# EAGLE design printer_v1 (EAGLE 9.6.2)
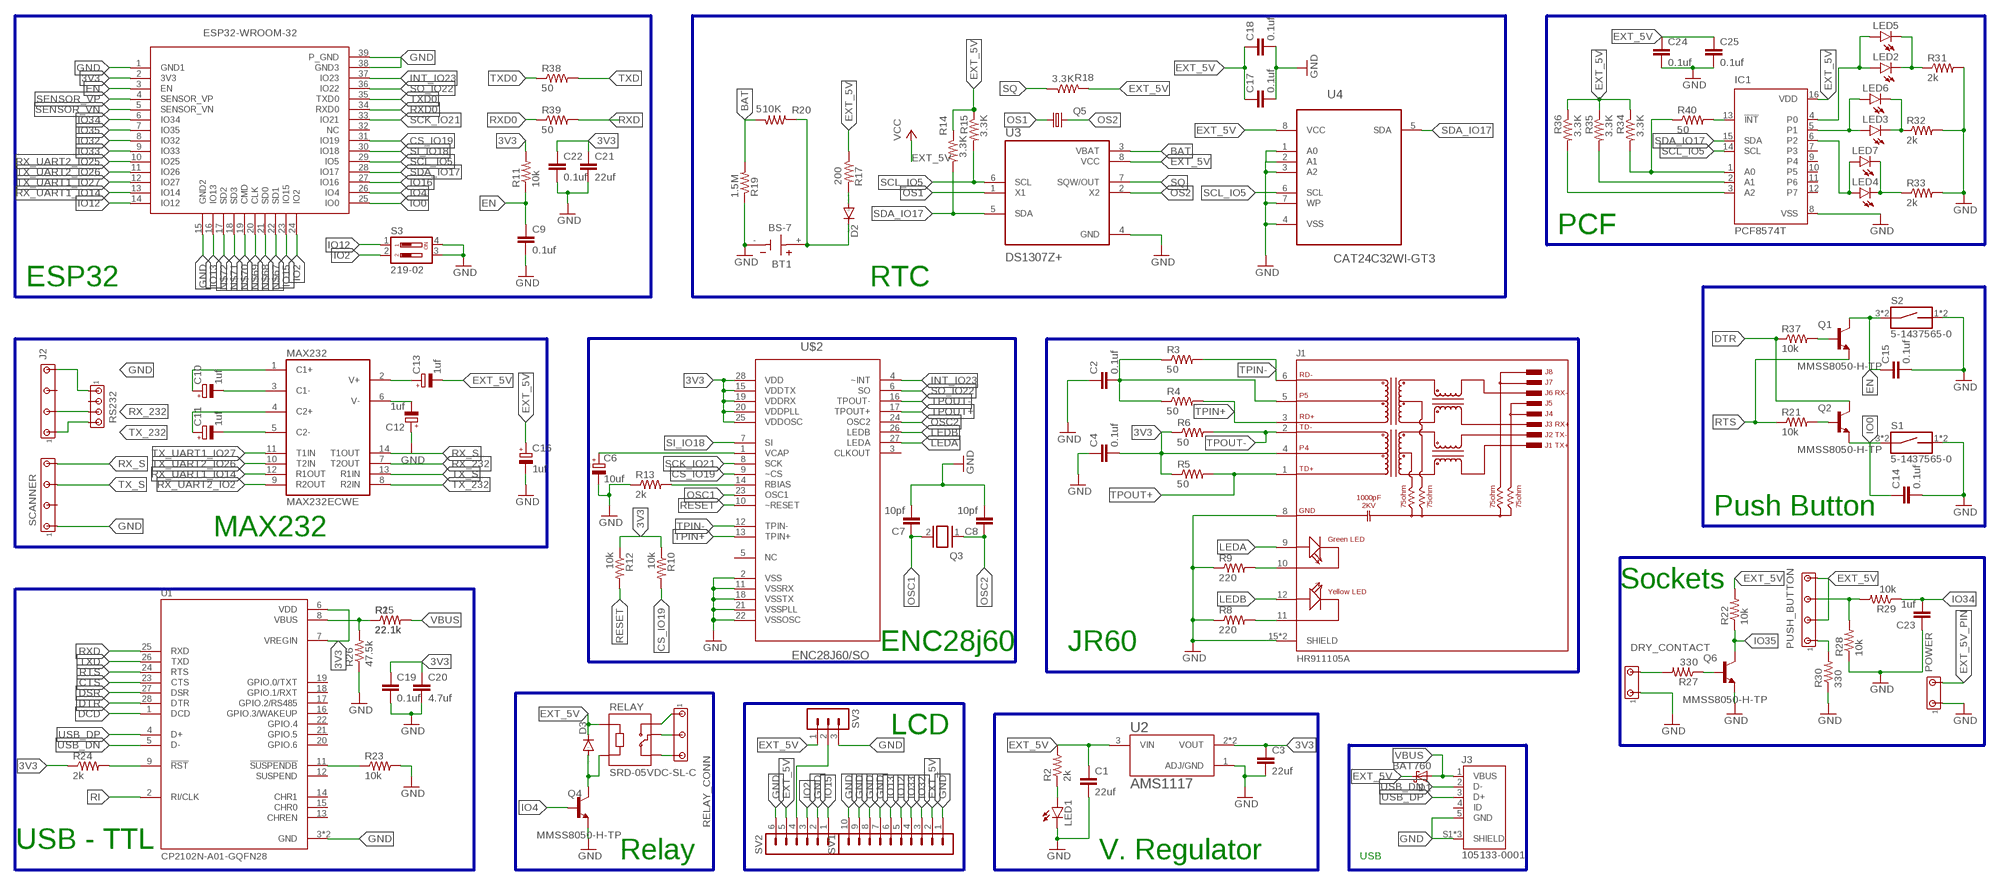
[diagram p0: schematic, sheet 1, part 1 of 2]
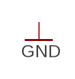
[diagram p1: schematic, sheet 1, part 2 of 2]

## Parts
BT1  BS-7  [BAT_BS-7]
C1  22uf  C-EUC0603  [C0603]
C2  0.1uf  C-EUC0402  [C0402]
C3  22uf  C-EUC0603  [C0603]
C4  0.1uf  C-EUC0402  [C0402]
C6  10uf  CPOL-EU153CLV-0405  [153CLV-0405]
C7  10pf  C-EUC0402  [C0402]
C8  10pf  C-EUC0402  [C0402]
C9  0.1uf  C-EUC0402  [C0402]
C10  1uf  CPOL-EUA/3216-18R  [A/3216-18R]
C11  1uf  CPOL-EUA/3216-18R  [A/3216-18R]
C12  1uf  CPOL-EUA/3216-18R  [A/3216-18R]
C13  1uf  CPOL-EUA/3216-18R  [A/3216-18R]
C14  0.1uf  C-EUC0402  [C0402]
C15  0.1uf  C-EUC0402  [C0402]
C16  1uf  CPOL-EUA/3216-18R  [A/3216-18R]
C17  0.1uf  C-EUC0402  [C0402]
C18  0.1uf  C-EUC0402  [C0402]
C19  0.1uf  C-EUC0402  [C0402]
C20  4.7uf  C-EUC0402  [C0402]
C21  22uf  C-EUC0603  [C0603]
C22  0.1uf  C-EUC0402  [C0402]
C23  1uf  C-EUC0603  [C0603]
C24  0.1uf  C-EUC0402  [C0402]
C25  0.1uf  C-EUC0402  [C0402]
D1  BAT760  [SOD323(F)]
D2  DIODE-DO-214AC  [DO-214AC]
D3  DIODE-DO-214AC  [DO-214AC]
DRY_CONTACT  MTA03-100_MYV  [10X03MTA_MYV]
IC1  PCF8574T  [SO16W]
J1  HR911105A  [HANRUN_HR911105A]
J2  MTA07-100_MYV  [10X07MTA_MYV]
J3  105133-0001  [MOLEX_105133-0001]
LED1  LEDSML0603  [SML0603]
LED2  LEDSML0603  [SML0603]
LED3  LEDSML0603  [SML0603]
LED4  LEDSML0603  [SML0603]
LED5  LED5MM  [LED5MM]
LED6  LED5MM  [LED5MM]
LED7  LED5MM  [LED5MM]
MAX232  MAX232ECWE  [SO16L]
POWER  MTA03-100_MYV  [10X03MTA_MYV]
PUSH_BUTTON  MTA07-100_MYV  [10X07MTA_MYV]
Q1  MMSS8050-H-TP  [TRANS_MMSS8050-H-TP]
Q2  MMSS8050-H-TP  [TRANS_MMSS8050-H-TP]
Q3  XTAL/S  [QS]
Q4  MMSS8050-H-TP  [TRANS_MMSS8050-H-TP]
Q5  KX-327-NHF  [3.2X1.5]
Q6  MMSS8050-H-TP  [TRANS_MMSS8050-H-TP]
R1  22.1k  R-US_R0402  [R0402]
R2  2k  R-US_R0402  [R0402]
R3  50  R-US_R0402  [R0402]
R4  50  R-US_R0402  [R0402]
R5  50  R-US_R0402  [R0402]
R6  50  R-US_R0402  [R0402]
R8  220  R-US_R0402  [R0402]
R9  220  R-US_R0402  [R0402]
R10  10k  R-US_R0402  [R0402]
R11  10k  R-US_R0402  [R0402]
R12  10k  R-US_R0402  [R0402]
R13  2k  R-US_R0402  [R0402]
R14  3.3K  R-US_R0603  [R0603]
R15  3.3K  R-US_R0603  [R0603]
R17  200  R-US_R0603  [R0603]
R18  3.3K  R-US_R0603  [R0603]
R19  1.5M  R-US_R0603  [R0603]
R20  510K  R-US_R0603  [R0603]
R21  10k  R-US_R0402  [R0402]
R22  10k  R-US_R0402  [R0402]
R23  10k  R-US_R0402  [R0402]
R24  2k  R-US_R0402  [R0402]
R25  22.1k  R-US_R0402  [R0402]
R26  47.5k  R-US_R0402  [R0402]
R27  330  R-US_R0402  [R0402]
R28  10k  R-US_R0402  [R0402]
R29  10k  R-US_R0402  [R0402]
R30  330  R-US_R0402  [R0402]
R31  2k  R-US_R0402  [R0402]
R32  2k  R-US_R0402  [R0402]
R33  2k  R-US_R0402  [R0402]
R34  3.3K  R-US_R0603  [R0603]
R35  3.3K  R-US_R0603  [R0603]
R36  3.3K  R-US_R0603  [R0603]
R37  10k  R-US_R0402  [R0402]
R38  50  R-US_R0402  [R0402]
R39  50  R-US_R0402  [R0402]
R40  50  R-US_R0402  [R0402]
RELAY  SRD-05VDC-SL-C  [RELAY_SRD-05VDC-SL-C]
RELAY_CONN  MTA05-156_MYVSPACE1  [10X05MTA_MYV]
RS232  MTA04-100  [10X04MTA]
S1  5-1437565-0  [SW_5-1437565-0]
S2  5-1437565-0  [SW_5-1437565-0]
S3  219-02  [CTS-219-02]
SCANNER  MTA07-100_MYV  [10X07MTA_MYV]
SV1  MA10-1  [MA10-1]
SV2  MA06-1  [MA06-1]
SV3  MA03-1  [MA03-1]
U1  CP2102N-A01-GQFN28  [QFN50P500X500X80-29N]
U2  AMS1117  [SOT229P700X180-4N]
U3  DS1307Z+  [SOIC127P600X175-8N]
U4  CAT24C32WI-GT3  [SOIC127P600X175-8N]
U$2  ENC28J60/SO  [SOIC127P1034X264-28N]
U$3  ESP32-WROOM-32  [ESP32-WROOM-32]

## Nets
3V3: C3.1 C4.2 C19.1 C20.1 C21.1 C22.1 J1.4 R5.1 R6.1 R10.1 R11.2 R12.1 R24.1 U1.6(VDD) U1.7(VREGIN) U2.2(VOUT) U2.4(VOUT) U$2.15(VDDTX) U$2.19(VDDRX) U$2.20(VDDPLL) U$2.25(VDDOSC) U$2.28(VDD) U$3.2(3V3)
BAT: R19.2 R20.2 U3.3(VBAT)
CS_IO19: R10.2 U$2.9(~CS) U$3.31(IO19)
CTS: U1.23(CTS)
DCD: U1.1(DCD)
DSR: U1.27(DSR)
DTR: Q2.3(C) R37.1 U1.28(DTR)
EN: C9.1 C15.1 Q1.3(C) R11.1 S2.3 S2.4 U$3.3(EN)
EXT_5V: C1.1 C13.- C16.+ C17.1 C18.1 C24.1 C25.1 D1.1(K) D3.C IC1.16(VDD) PUSH_BUTTON.3 PUSH_BUTTON.7 R2.2 R14.1 R15.1 R17.1 R18.2 R22.2 R34.1 R35.1 R36.1 RELAY.A1 SV1.2 SV2.5 SV3.1 U2.3(VIN) U3.8(VCC) U4.8(VCC) ; supply symbol labelled VCC
EXT_5V_PIN: POWER.3
GND: BT1.- C1.2 C2.1 C3.2 C4.1 C6.- C7.2 C8.2 C9.2 C12.+ C14.2 C15.2 C16.- C17.2 C18.2 C19.2 C20.2 C21.2 C22.2 C23.1 C24.2 C25.2 DRY_CONTACT.1 IC1.8(VSS) J1.8(GND) J1.15(SHIELD) J1.16(SHIELD) J2.7 J3.5(GND) J3.S1(SHIELD) J3.S2(SHIELD) J3.S3(SHIELD) LED1.C POWER.1 Q4.2(E) Q6.2(E) R8.1 R9.1 R13.1 R19.1 R23.2 R26.1 R28.1 R30.1 R31.2 R32.2 R33.2 RS232.1 S1.1 S1.2 S2.1 S2.2 S3.3 S3.4 SCANNER.1 SV1.1 SV1.7 SV1.8 SV1.9 SV1.10 SV2.2 SV2.6 SV3.3 U1.3(GND) U1.29(GND) U2.1(ADJ/GND) U3.4(GND) U4.1(A0) U4.2(A1) U4.3(A2) U4.4(VSS) U4.7(WP) U$2.2(VSS) U$2.11(VSSRX) U$2.18(VSSTX) U$2.21(VSSPLL) U$2.22(VSSOSC) U$3.1(GND1) U$3.15(GND2) U$3.38(GND3) U$3.39(P_GND)
INT_IO23: U$2.4(~INT) U$3.37(IO23)
IO0: C14.1 Q2.2(E) S1.3 S1.4 U$3.25(IO0)
IO2: S3.2 SV2.3 U$3.24(IO2)
IO4: Q4.1(B) U$3.26(IO4)
IO12: S3.1 SV1.5 U$3.14(IO12)
IO13: SV1.6 U$3.16(IO13)
IO15: SV2.1 U$3.23(IO15)
IO16: U$3.27(IO16)
IO32: SV1.3 U$3.8(IO32)
IO33: SV1.4 U$3.9(IO33)
IO34: C23.2 R29.1 U$3.6(IO34)
IO35: Q6.3(C) R22.1 U$3.7(IO35)
LEDA: J1.9(GA) U$2.27(LEDA)
LEDB: J1.12(YA) U$2.26(LEDB)
N$1: LED1.A R2.1
N$2: Q1.1(B) R37.2
N$3: Q2.1(B) R21.2
N$4: R1.1 R25.1 R26.2 U1.8(VBUS)
N$5: SV2.4 SV3.2
N$6: R23.1 U1.11(!SUSPENDB)
N$7: J1.11(YC) R8.2
N$8: C2.2 J1.5 R3.1 R4.1
N$9: J1.10(GC) R9.2
N$10: R13.2 U$2.14(RBIAS)
N$11: C6.+ U$2.1(VCAP)
N$12: C10.+ MAX232.1(C1+)
N$14: C10.- MAX232.3(C1-)
N$15: C11.- MAX232.5(C2-)
N$16: R24.2 U1.9(!RST)
N$18: C11.+ MAX232.4(C2+)
N$19: C12.- MAX232.6(V-)
N$20: C13.+ MAX232.2(V+)
N$21: RELAY.NC RELAY_CONN.5
N$22: RELAY.COM RELAY_CONN.3
N$23: LED2.C LED5.K(C) R31.1
N$24: IC1.13(!INT) R40.2
N$26: RELAY.NO RELAY_CONN.1
N$27: D3.A Q4.3(C) RELAY.A2
N$28: D2.A R17.2
N$29: BT1.+ D2.C R20.1
N$32: Q6.1(B) R27.1
N$33: PUSH_BUTTON.5 R28.2 R29.2
N$35: DRY_CONTACT.3 R27.2
N$36: IC1.4(P0) LED2.A LED5.A
N$37: IC1.5(P1) LED3.A LED6.A
N$38: IC1.6(P2) LED4.A LED7.A
N$40: PUSH_BUTTON.1 R30.2
N$45: IC1.1(A0) R34.2 R40.1
N$46: IC1.2(A1) R35.2
N$47: IC1.3(A2) R36.2
N$48: LED3.C LED6.K(C) R32.1
N$49: LED4.C LED7.K(C) R33.1
N$67: U$3.22(SD1)
N$68: U$3.21(SD0)
N$69: U$3.20(CLK)
N$70: U$3.19(CMD)
N$71: U$3.18(SD3)
N$72: U$3.17(SD2)
OS1: Q5.1 U3.1(X1)
OS2: Q5.2 U3.2(X2)
OSC1: C7.1 Q3.2 U$2.23(OSC1)
OSC2: C8.1 Q3.1 U$2.24(OSC2)
RESET: R12.2 U$2.10(~RESET)
RI: U1.2(RI/CLK)
RTS: Q1.2(E) R21.1 U1.24(RTS)
RX_232: J2.3 MAX232.7(T2OUT) RS232.3
RX_S: MAX232.14(T1OUT) SCANNER.7
RX_UART1_IO14: MAX232.12(R1OUT) U$3.13(IO14)
RX_UART2_IO2: MAX232.9(R2OUT)
RX_UART2_IO25: U$3.10(IO25)
RXD: R39.2 U1.25(RXD)
RXD0: R39.1 U$3.34(RXD0)
SCK_IO21: U$2.8(SCK) U$3.33(IO21)
SCL_IO5: IC1.14(SCL) R15.2 U3.6(SCL) U4.6(SCL) U$3.29(IO5)
SDA_IO17: IC1.15(SDA) R14.2 U3.5(SDA) U4.5(SDA) U$3.28(IO17)
SENSOR_VN: U$3.5(SENSOR_VN)
SENSOR_VP: U$3.4(SENSOR_VP)
SI_IO18: U$2.7(SI) U$3.30(IO18)
SO_IO22: U$2.6(SO) U$3.36(IO22)
SQ: R18.1 U3.7(SQW/OUT)
TPIN+: J1.3(RD+) R4.2 U$2.13(TPIN+)
TPIN-: J1.6(RD-) R3.2 U$2.12(TPIN-)
TPOUT+: J1.1(TD+) R5.2 U$2.17(TPOUT+)
TPOUT-: J1.2(TD-) R6.2 U$2.16(TPOUT-)
TX_232: J2.1 MAX232.8(R2IN) RS232.4
TX_S: MAX232.13(R1IN) SCANNER.5
TX_UART1_IO27: MAX232.11(T1IN) U$3.12(IO27)
TX_UART2_IO26: MAX232.10(T2IN) U$3.11(IO26)
TXD: R38.2 U1.26(TXD)
TXD0: R38.1 U$3.35(TXD0)
USB_DN: J3.2(D-) U1.5(D-)
USB_DP: J3.3(D+) U1.4(D+)
VBUS: D1.2(A) J3.1(VBUS) R1.2 R25.2
Unconnected: IC1.7(P3) IC1.9(P4) IC1.10(P5) IC1.11(P6) IC1.12(P7) J2.5 J3.4(ID) RS232.2 SCANNER.3 U1.12(SUSPEND) U1.13(CHREN) U1.14(CHR1) U1.15(CHR0) U1.16(GPIO.3/WAKEUP) U1.17(GPIO.2/RS485) U1.18(GPIO.1/RXT) U1.19(GPIO.0/TXT) U1.20(GPIO.6) U1.21(GPIO.5) U1.22(GPIO.4) U$2.3(CLKOUT) U$2.5(NC) U$3.32(NC)

## Buses
B$1
B$2
EXT_5V,GND,N$28,BAT,N$29
B$3
B$4
B$5
B$6
B$7
GND,EXT_5V_PIN
B$8
VBUS,GND,USB_DN,N$6,3V3,RI,RTS,RXD,TXD,CTS,DSR,N$4,DTR,DCD,USB_DP,N$16
B$9
B$10

## Notes on the sheet
- PCF
- ESP32 | RTC
- Push Button
- MAX232
- Sockets
- ENC28j60 | JR60
- LCD
- USB - TTL
- Relay | V. Regulator | USB

## Power pins joined to a net without a drawn wire
EXT_5V: MAX232.16(VCC)
GND: MAX232.15(GND)

## Library data of the parts
BT1 = BS-7:BS-7: BATTERY HOLDER COIN 20MM PC PIN; AVAILABILITY: Unavailable; DESCRIPTION: BATTERY HOLDER COIN 20MM PC PIN; MF: MPD _Memory; MP: BS-7; PACKAGE: None; PRICE: None
C1-C4 C7-C9 C14 C15 C17-C25 = rcl:C-EU: CAPACITOR, European symbol; SPICEPREFIX: C
C6 C10-C13 C16 = rcl:CPOL-EU: POLARIZED CAPACITOR, European symbol; SPICEPREFIX: C
D1 = BAT760:BAT760: Medium power Schottky barrier single diode Planar medium power Schottky barrier single diode with an integrated guard ring for stress protection, encapsulated in a SOD323 (SC-76) very small Surface-Mounted Device SMD plastic package. AAL Eindhoven MK; AVAILABILITY: Unavailable; DESCRIPTION: Diode Schottky 30V 1A Surface Mount SOD-323; MF: Nexperia USA; MP: BAT760; PACKAGE: SOD-323 NXP Semiconductors; PRICE: None
D2 D3 = diode:DIODE-: DIODE
DRY_CONTACT POWER = con-amp_edit:MTA03-100_MYV: AMP connector
IC1 = micro-philips:PCF8574: I2C-Bus Remote 8-bit I/O expander http://www.semiconductors.philips.com/acrobat_download/datasheets/PCF8574_4.pdf; MPN: PCF8574T/3,512; OC_FARNELL: 1201255; OC_NEWARK: 70R6870
J1 = HR911105A:HR911105A: DIP RJ45 Connector;; AVAILABILITY: Unavailable; DESCRIPTION: HR911105A Ethernet Interface Arduino Platform Evaluation Expansion Board; MF: DFRobot; MP: HR911105A; PACKAGE: None; PRICE: None
J2 PUSH_BUTTON SCANNER = con-amp_edit:MTA07-100_MYV: AMP connector
J3 = 105133-0001:105133-0001: Conn Micro USB Type B RCP 5 POS 0.65mm Solder RA SMD 5 Terminal 1 Port Embossed T/R; AVAILABILITY: Unavailable; DESCRIPTION: USB - micro B USB 2.0 Receptacle Connector 5 Position Surface Mount; MF: Molex; MP: 105133-0001; PACKAGE: None; PRICE: None
LED1-LED4 = led:LED: LED OSRAM: - CHIPLED LG R971, LG N971, LY N971, LG Q971, LY Q971, LO R971, LY R971 LH N974, LH R974 LS Q976, LO Q976, LY Q976 LO Q996 - Hyper CHIPLED LW Q18S LB Q993, LB Q99A, LB R99A - SideLED LS A670, LO A670, LY A670, LG A670, LP A670 LB A673, LV A673, LT A673, LW A673 LH A674 LY A675 LS A676, LA A676, LO A676, LY A676, LW A676 LS A679, LY A679, LG A679 - Hyper Micro SIDELED® LS Y876, LA Y876, LO Y876, LY Y876 LT Y87S - SmartLED LW L88C, LW L88S LB L89C, LB L89S, LG L890 LS L89K, LO L89K, LY L89K LS L896, LA L896, LO L896, LY L896 - TOPLED LS T670, LO T670, LY T670, LG T670, LP T670 LSG T670, LSP T670, LSY T670, LOP T670, LYG T670 LG T671, LOG T671, LSG T671 LB T673, LV T673, LT T673, LW T673 LH T674 LS T676, LA T676, LO T676, LY T676, LB T676, LH T676, LSB T676, LW T676 LB T67C, LV T67C, LT T67C, LS T67K, LO T67K, LY T67K, LW E67C LS E67B, LA E67B, LO E67B, LY E67B, LB E67C, LV E67C, LT E67C LW T67C LS T679, LY T679, LG T679 LS T770, LO T770, LY T770, LG T770, LP T770 LB T773, LV T773, LT T773, LW T773 LH T774 LS E675, LA E675, LY E675, LS T675 LS T776, LA T776, LO T776, LY T776, LB T776 LHGB T686 LT T68C, LB T68C - Hyper Mini TOPLED® LB M676 - Mini TOPLED Santana® LG M470 LS M47K, LO M47K, LY M47K Source: http://www.osram.convergy.de LUXEON: - LUMILED® LXK2-PW12-R00, LXK2-PW12-S00, LXK2-PW14-U00, LXK2-PW14-V00 LXK2-PM12-R00, LXK2-PM12-S00, LXK2-PM14-U00 LXK2-PE12-Q00, LXK2-PE12-R00, LXK2-PE12-S00, LXK2-PE14-T00, LXK2-PE14-U00 LXK2-PB12-K00, LXK2-PB12-L00, LXK2-PB12-M00, LXK2-PB14-N00, LXK2-PB14-P00, LXK2-PB14-Q00 LXK2-PR12-L00, LXK2-PR12-M00, LXK2-PR14-Q00, LXK2-PR14-R00 LXK2-PD12-Q00, LXK2-PD12-R00, LXK2-PD12-S00 LXK2-PH12-R00, LXK2-PH12-S00 LXK2-PL12-P00, LXK2-PL12-Q00, LXK2-PL12-R00 Source: www.luxeon.com KINGBRIGHT: KA-3528ASYC Source: www.kingbright.com
LED5-LED7 = led_MYVV:LED: LED OSRAM: - CHIPLED LG R971, LG N971, LY N971, LG Q971, LY Q971, LO R971, LY R971 LH N974, LH R974 LS Q976, LO Q976, LY Q976 LO Q996 - Hyper CHIPLED LW Q18S LB Q993, LB Q99A, LB R99A - SideLED LS A670, LO A670, LY A670, LG A670, LP A670 LB A673, LV A673, LT A673, LW A673 LH A674 LY A675 LS A676, LA A676, LO A676, LY A676, LW A676 LS A679, LY A679, LG A679 - Hyper Micro SIDELED® LS Y876, LA Y876, LO Y876, LY Y876 LT Y87S - SmartLED LW L88C, LW L88S LB L89C, LB L89S, LG L890 LS L89K, LO L89K, LY L89K LS L896, LA L896, LO L896, LY L896 - TOPLED LS T670, LO T670, LY T670, LG T670, LP T670 LSG T670, LSP T670, LSY T670, LOP T670, LYG T670 LG T671, LOG T671, LSG T671 LB T673, LV T673, LT T673, LW T673 LH T674 LS T676, LA T676, LO T676, LY T676, LB T676, LH T676, LSB T676, LW T676 LB T67C, LV T67C, LT T67C, LS T67K, LO T67K, LY T67K, LW E67C LS E67B, LA E67B, LO E67B, LY E67B, LB E67C, LV E67C, LT E67C LW T67C LS T679, LY T679, LG T679 LS T770, LO T770, LY T770, LG T770, LP T770 LB T773, LV T773, LT T773, LW T773 LH T774 LS E675, LA E675, LY E675, LS T675 LS T776, LA T776, LO T776, LY T776, LB T776 LHGB T686 LT T68C, LB T68C - Hyper Mini TOPLED® LB M676 - Mini TOPLED Santana® LG M470 LS M47K, LO M47K, LY M47K Source: http://www.osram.convergy.de LUXEON: - LUMILED® LXK2-PW12-R00, LXK2-PW12-S00, LXK2-PW14-U00, LXK2-PW14-V00 LXK2-PM12-R00, LXK2-PM12-S00, LXK2-PM14-U00 LXK2-PE12-Q00, LXK2-PE12-R00, LXK2-PE12-S00, LXK2-PE14-T00, LXK2-PE14-U00 LXK2-PB12-K00, LXK2-PB12-L00, LXK2-PB12-M00, LXK2-PB14-N00, LXK2-PB14-P00, LXK2-PB14-Q00 LXK2-PR12-L00, LXK2-PR12-M00, LXK2-PR14-Q00, LXK2-PR14-R00 LXK2-PD12-Q00, LXK2-PD12-R00, LXK2-PD12-S00 LXK2-PH12-R00, LXK2-PH12-S00 LXK2-PL12-P00, LXK2-PL12-Q00, LXK2-PL12-R00 Source: www.luxeon.com KINGBRIGHT: KA-3528ASYC Source: www.kingbright.com
MAX232 = maxim:MAX232ECWE: RS232 TRANSCEIVER; MF: MAXIM; MPN: MAX232ECWE+; OC_FARNELL: 9724435; OC_NEWARK: 67K4440
Q1 Q2 Q4 Q6 = MMSS8050-H-TP:MMSS8050-H-TP: MMSS8050-H Series 25 V 1.5 A NPN Silicon Plastic-Encapsulate Transistor-SOT-23; AVAILABILITY: Unavailable; DESCRIPTION: Bipolar _BJT_ Transistor NPN 25V 1.5A 100MHz 625mW Surface Mount SOT-23; MF: Micro Commercial; MP: MMSS8050-H-TP; PACKAGE: SOT-23 Micro Commercial; PRICE: None
Q3 = special:XTAL/S: CRYSTAL
Q5 = crystal-geyer_V1_0:KX-327: Tuning Fork Crystals (kHz) SMD: KX327 - Serie Model Size l/w/h [mm] Frequency Range Frequency Stability Temp. Range [°C] Load Capacitance AECQ 200 availabel Datasheet KX-327VT KX-327FT KX-327RT KX-327NHT KX-327NHF KX-327L KX-327S 1.25/1.05/0.5 1.6/1.0/0.5 2.0/1.2/0.6 3.2/1.5/0.8 3.2/1.5/0.8 7.0/1.5/1.4 8.2/3.8/2.5 32,768 kHz 32,768 kHz 32,768 kHz 32,768 kHz 32,768 kHz 32,768 kHz 32,768 kHz ±10 … ±20ppm ±10 … ±20ppm ±10 … ±20ppm ±10 … ±20ppm ±10 … ±20ppm ±10 … ±20ppm ±5 … ±20ppm (*) -40°C …+85°C (*) -40°C …+85°C (*) -40°C …+85°C (*) -40°C …+85°C (*) -40°C …+125°C (*) -40°C …+85°C (*) -40°C …+85°C 7/9/12,5 7/9/12,5 7/9/12,6 7/9/12,5 9/12,5 7/9/12,5 6/12,5 - - - - yes - - KX-327VT.pdf <http://www.geyer-electronic.de/uploads/tx_userartikelfrequenz/GEYER-KX-327VT.pdf> KX-327FT.pdf <http://www.geyer-electronic.de/uploads/tx_userartikelfrequenz/GEYER-KX-327FT.pdf> KX-327RT.pdf <http://www.geyer-electronic.de/uploads/tx_userartikelfrequenz/GEYER-KX-327RT.pdf> KX-327NHT.pdf <http://www.geyer-electronic.de/uploads/tx_userartikelfrequenz/GEYER-KX-327NHT.pdf> KX-327NHF.pdf <http://www.geyer-electronic.de/uploads/tx_userartikelfrequenz/GEYER-KX-327NHF.pdf> KX-327L.pdf <http://www.geyer-electronic.de/uploads/tx_userartikelfrequenz/GEYER-KX-327L.pdf> KX-327S.pdf <http://www.geyer-electronic.de/uploads/tx_userartikelfrequenz/GEYER-KX-327S.pdf> <http://www.geyer-electronic.de/fileadmin/template/img/logo-geyer-electronic.png> Details see: http://www.geyer-electronic.de/Frequenz-Produkte.9.0.html Created 2016-06-07, Hans Locher 2016 (C) Geyer Quartz Technology KX327VT,KX327FT,KX327RT,KX327NHT,KX327NHF,KX327S,KX327L;125105;1610;2012;3215;7015;8238;1,25x1,05,1.25x1.05;1,6x1,0,1.6x1.0;2,0x1,2,2.0x1.2;3,2x1,5,3.2x1.5;8,2x3,8,8.2x3.8,7.0x1.5,7,0x1,532.768kHz
R1-R6 R8-R15 R17-R40 = rcl:R-US_: RESISTOR, American symbol; SPICEPREFIX: R
RELAY = SRD-05VDC-SL-C:SRD-05VDC-SL-C: 5V Trigger Relay Module For Arduino And Raspberry Pi 5V Trigger Relay Module For Arduino And Raspberry Pi; AVAILABILITY: Unavailable; DESCRIPTION: 5V Trigger Relay Module For Arduino And Raspberry Pi 5V Trigger Relay Module For Arduino And Raspberry Pi; MF: Songle Relay; MP: SRD-05VDC-SL-C; PACKAGE: None; PRICE: None
RELAY_CONN = con-amp_edit:MTA05-156_MYV: AMP connector
RS232 = con-amp:MTA04-100: AMP connector
S1 S2 = 5-1437565-0:5-1437565-0: Switch Tactile OFF (ON) Round Button Gull Wing 0.05A 12VDC 1.57N SMD T/R; AVAILABILITY: Unavailable; COMMENT: 5-1437565-0; DESCRIPTION: Switch Push Button N.O. SPST Round Button 0.05A 12VDC 1VA Alternate Contact Gull Wing SMD T/R; MF: TE Connectivity; MP: FSM6JSMATR; PACKAGE: None; PRICE: None; TE_PURCHASE_URL: https://www.te.com/usa-en/product-5-1437565-0.html?te_bu=Cor&te_type=disp&te_campaign=seda_glo_cor-seda-global-disp-prtnr-fy19-seda-model-bom-cta_sma-317_1&elqCampaignId=32493
S3 = switch-dil:219-02*: Surface Mount DIP Switch Series 219 SMT CTS Electronic Components Sourc: www.ctscorp.com; OC_FARNELL: unknown; OC_NEWARK: unknown
SV1 = con-lstb:MA10-1: PIN HEADER; OC_FARNELL: unknown; OC_NEWARK: unknown
SV2 = con-lstb:MA06-1: PIN HEADER; OC_FARNELL: unknown; OC_NEWARK: unknown
SV3 = con-lstb:MA03-1: PIN HEADER; OC_FARNELL: unknown; OC_NEWARK: unknown
U1 = CP2102N-A01-GQFN28:CP2102N-A01-GQFN28: Ic Bridge Usb To Uart 28qfn; DESCRIPTION: USB Bridge, USB to UART USB 2.0 UART Interface 28-QFN _5x5_; DIGI-KEY_PART_NUMBER: 336-3694-ND; DIGI-KEY_PURCHASE_URL: https://www.digikey.com/product-detail/en/silicon-labs/CP2102N-A01-GQFN28/336-3694-ND/6012519?utm_source=snapeda&utm_medium=aggregator&utm_campaign=symbol; MF: Silicon Labs; MP: CP2102N-A01-GQFN28; PACKAGE: QFN-28 Silicon Labs
U2 = AMS1117:AMS1117: Sot223/Pkg 1-Amp 5-Volt Low Drop Out Voltage Regulatator; AVAILABILITY: Unavailable; DESCRIPTION: UNO PLUS Arduino R3 Shield, Xbee Arduino IDE Wheeled Robotics Kit; MF: Seeed Technology; MP: AMS1117; PACKAGE: SOT-223 Seeed Technology; PRICE: None
U3 = DS1307Z_:DS1307Z+; AVAILABILITY: Unavailable; DESCRIPTION: Real Time Clock _RTC_ IC Clock/Calendar 56B I²C, 2-Wire Serial 8-SOIC _0.154, 3.90mm Width_; MF: Maxim Integrated; MP: DS1307Z; PACKAGE: SO-8 Maxim Integrated; PRICE: None
U4 = CAT24C32WI-GT3:CAT24C32WI-GT3: 32-Kb I2C CMOS Serial EEPROM; AVAILABILITY: Unavailable; DESCRIPTION: EEPROM Memory IC 32Kb _4K x 8_ I²C 1MHz 400ns 8-SOIC; MF: ON; MP: CAT24C32WI-GT3; PACKAGE: SOIC-8 ON; PRICE: None
U$2 = ENC28J60_SO:ENC28J60/SO: Stand-Alone Ethernet Controller;; AVAILABILITY: Unavailable; DESCRIPTION: Ethernet Controller 10 Base-T PHY SPI Interface 28-SSOP; MF: Microchip; MP: ENC28J60/SS; PACKAGE: SSOP-28 Microchip; PRICE: None
U$3 = ESP32-WROOM-32:ESP32-WROOM-32: ESP32-WROOM-32 Module; AVAILABILITY: Unavailable; DESCRIPTION: Bluetooth, WiFi Transceiver Module 2.4GHz ~ 2.5GHz Surface Mount; MF: Espressif Systems; MP: ESP32-WROOM-32; PACKAGE: Module Espressif Systems; PRICE: None

## Board
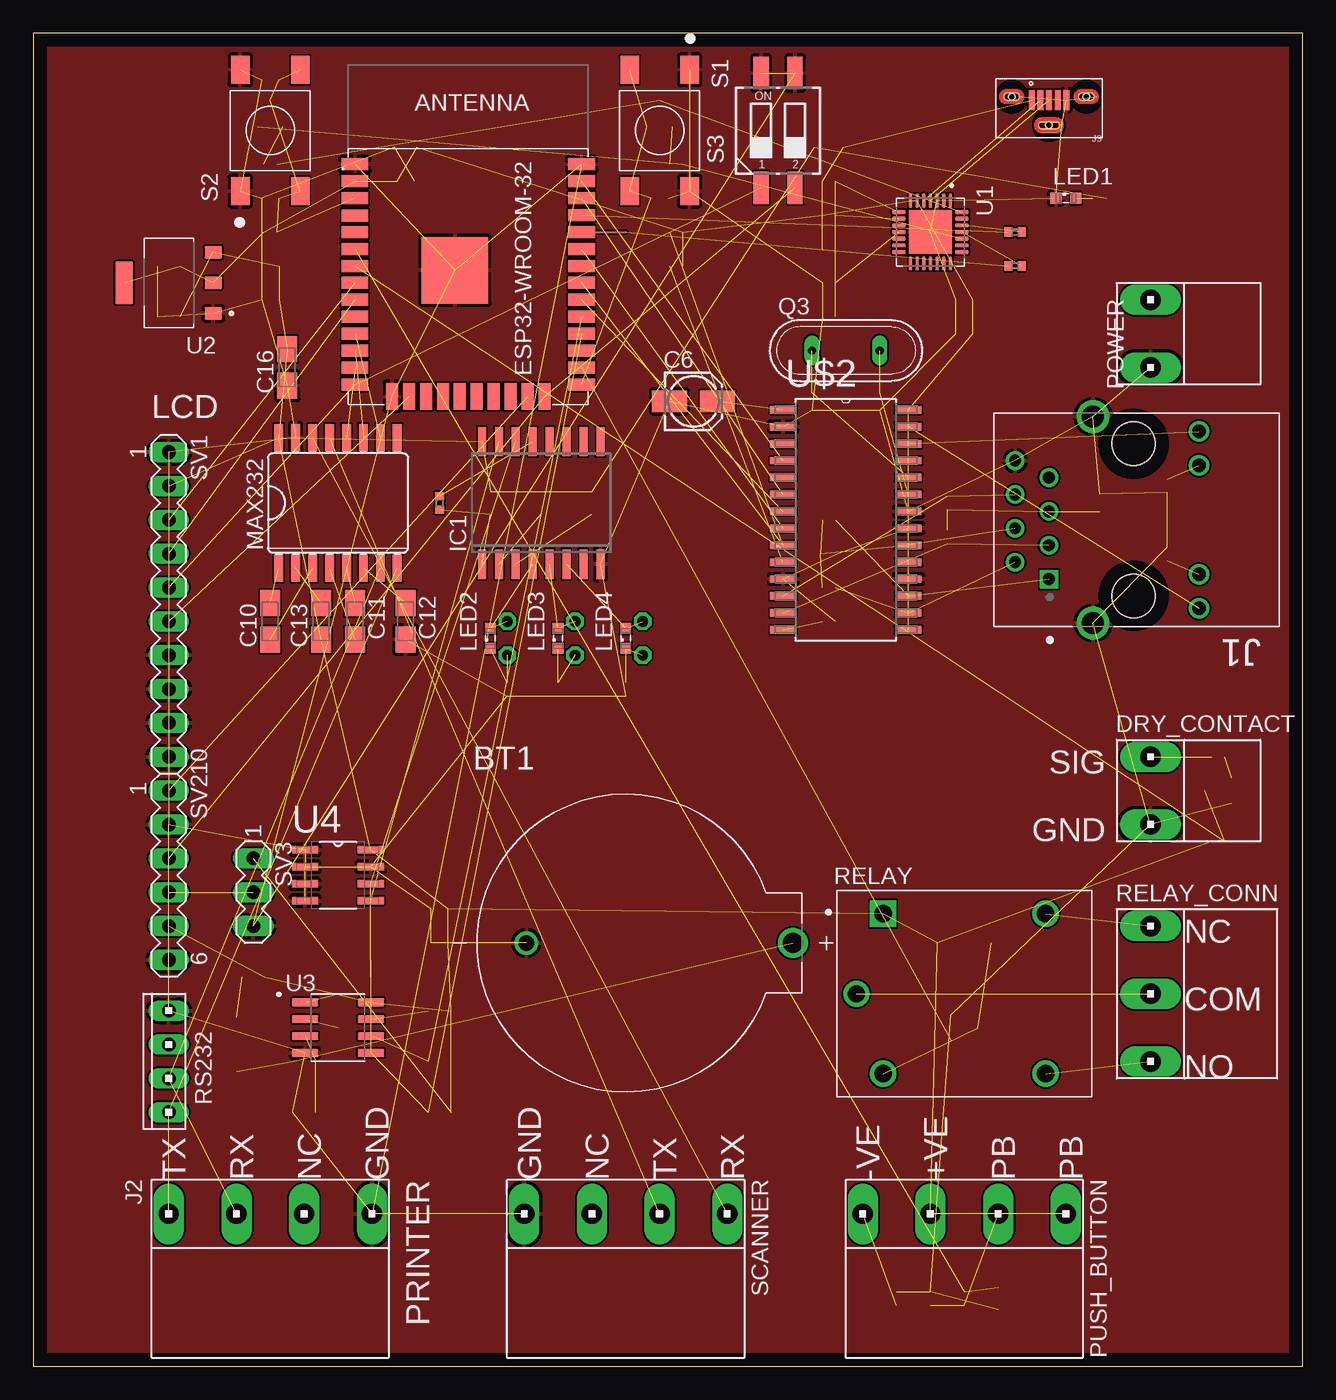
[diagram p2: board, top side]
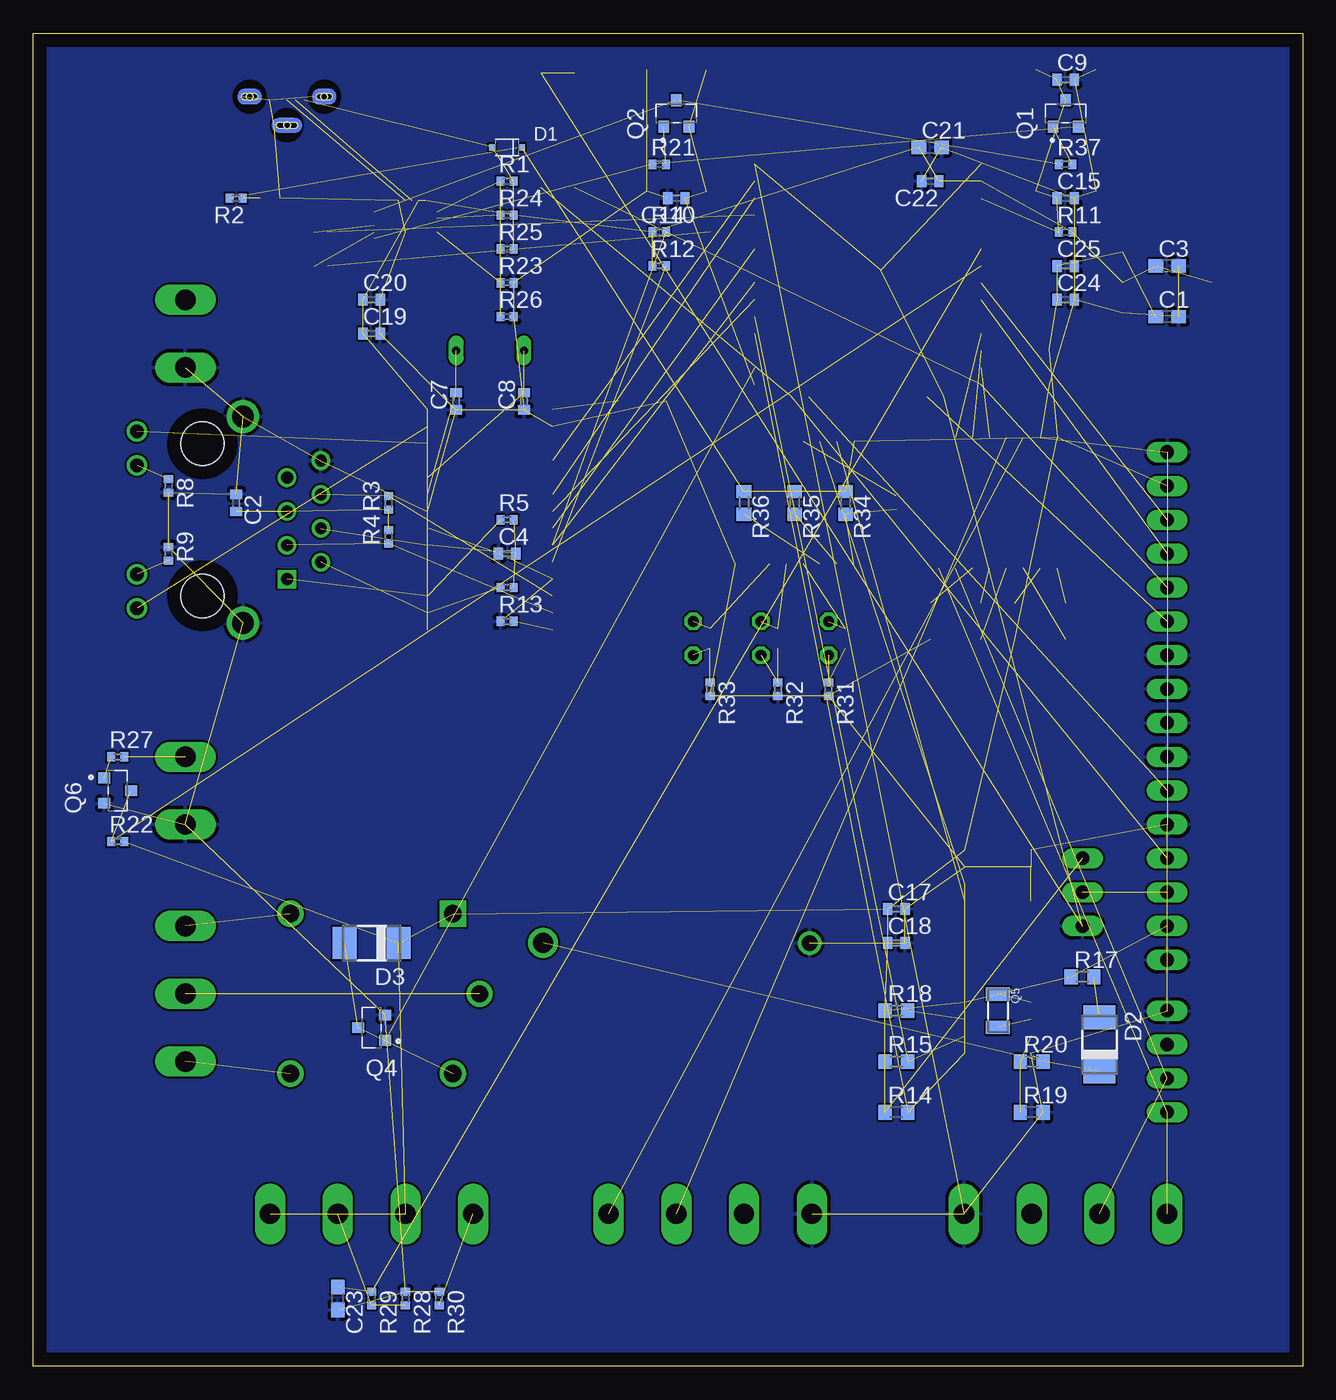
[diagram p3: board, bottom side, seen from below]

Size 95.23 x 100 mm. Coordinates in mm from the lower left corner, seen from the top.
Outline: 0,0 95.23,0 95.23,100 0,100 0,0
Copper layers (1*16): Top 0.035mm / dielectric 1.5mm / Bottom 0.035mm
Design rules "default": minimum track width 6mil, minimum drill 0.35mm, track to track 6mil, track to pad 6mil, pad to pad 6mil, via to via 6mil, smd to smd 6mil, copper to edge 40mil, drill to drill 6mil, minimum pad ring 10mil, minimum via ring 8mil, stop-mask expansion 4mil, vias tented up to drill 0mil, thermal gap 10mil

### Footprints (pad centres in the part's own frame; a part is rotated, then mirrored left to right if it is on the bottom)
BAT_BS-7 = drill 1.5: + 10,0 | drill 1.17: - -10,0
C0603 = smd 1.1 x 1: 1 -0.85,0; 2 0.85,0
C0402 = smd 0.7 x 0.9: 1 -0.65,0; 2 0.65,0
153CLV-0405 = smd 2.6 x 1.6: + 1.8,0; - -1.8,0
A/3216-18R = smd 1.95 x 1.5: + 1.375,0; - -1.375,0
SOD323(F) = smd 0.5 x 0.5: 1 1.1,0; 2 -1.1,0
DO-214AC = smd 1.8 x 2.4: A 2.025,0; C -2.025,0
10X03MTA_MYV = drill 1.524 long: 1 2.54,0; 3 -2.54,0
SO16W = smd 0.6 x 2.2: 1 -4.445,-4.6; 2 -3.175,-4.6; 3 -1.905,-4.6; 4 -0.635,-4.6; 5 0.635,-4.6; 6 1.905,-4.6; 7 3.175,-4.6; 8 4.445,-4.6; 9 4.445,4.6; 10 3.175,4.6; 11 1.905,4.6; 12 0.635,4.6; 13 -0.635,4.6; 14 -1.905,4.6; 15 -3.175,4.6; 16 -4.445,4.6
HANRUN_HR911105A = drill 0.89 square: 1 4.45,-6.35 | drill 0.89: 2 3.18,-8.89; 3 1.91,-6.35; 4 0.64,-8.89; 5 -0.63,-6.35; 6 -1.9,-8.89; 7 -3.17,-6.35; 8 -4.44,-8.89 | drill 1.02: 9 6.625,4.9; 10 4.085,4.9; 11 -4.085,4.9; 12 -6.625,4.9 | drill 1.63: 15 7.745,-3.05; 16 -7.745,-3.05 | hole 3.25: -5.715,0; 5.715,0
10X07MTA_MYV = drill 1.524 long: 1 7.62,0; 3 2.54,0; 5 -2.54,0; 7 -7.62,0
MOLEX_105133-0001 = smd 0.45 x 1.5: 1 -1.3,-0.25; 2 -0.65,-0.25; 3 0,-0.25; 4 0.65,-0.25; 5 1.3,-0.25 | smd 0.1 x 0.1: S1 -2.05,0; S2 3.55,0; S3 0.95,-2.15 | hole 0.5: -2.8,0; 2.8,0; 0,-2.15
SML0603 = smd 0.8 x 0.8: A 0.75,0; C -0.75,0
LED5MM = drill 0.813 octagon: A -1.27,0; K 1.27,0
SO16L = smd 0.66 x 2.032: 1 -4.445,-4.902; 2 -3.175,-4.902; 3 -1.905,-4.902; 4 -0.635,-4.902; 5 0.635,-4.902; 6 1.905,-4.902; 7 3.175,-4.902; 8 4.445,-4.902; 9 4.445,4.902; 10 3.175,4.902; 11 1.905,4.902; 12 0.635,4.902; 13 -0.635,4.902; 14 -1.905,4.902; 15 -3.175,4.902; 16 -4.445,4.902
TRANS_MMSS8050-H-TP = smd 0.9 x 0.8: 1 -1,0.95; 2 -1,-0.95; 3 1,0
QS = drill 0.61 long: 1 -2.54,0; 2 2.54,0
3.2X1.5 = smd 1 x 1.8: 1 -1.25,0; 2 1.25,0
R0402 = smd 0.6 x 0.7: 1 -0.5,0; 2 0.5,0
R0603 = smd 1 x 1.1: 1 -0.85,0; 2 0.85,0
RELAY_SRD-05VDC-SL-C = drill 1.32 square: A1 -6.1,6 | drill 1.32: A2 -6.1,-6; NC 6.1,6; NO 6.1,-6 | drill 1.29: COM -8.1,0
10X05MTA_MYV = drill 1.524 long: 1 5.08,0; 3 0,0; 5 -5.08,0
10X04MTA = drill 1.016 long: 1 3.81,0; 2 1.27,0; 3 -1.27,0; 4 -3.81,0
SW_5-1437565-0 = smd 2.1 x 1.4: 1 -4.55,2.25; 2 4.55,2.25; 3 -4.55,-2.25; 4 4.55,-2.25
CTS-219-02 = smd 1.13 x 2.44: 1 -1.27,-4.3; 2 1.27,-4.3; 3 1.27,4.3; 4 -1.27,4.3
MA10-1 = drill 1.016 long: 1 -11.43,0; 2 -8.89,0; 3 -6.35,0; 4 -3.81,0; 5 -1.27,0; 6 1.27,0; 7 3.81,0; 8 6.35,0; 9 8.89,0; 10 11.43,0
MA06-1 = drill 1.016 long: 1 -6.35,0; 2 -3.81,0; 3 -1.27,0; 4 1.27,0; 5 3.81,0; 6 6.35,0
MA03-1 = drill 1.016 long: 1 -2.54,0; 2 0,0; 3 2.54,0
QFN50P500X500X80-29N = smd 1.01 x 0.27: 1 -2.36,1.5; 2 -2.36,1; 3 -2.36,0.5; 4 -2.36,0; 5 -2.36,-0.5; 6 -2.36,-1; 7 -2.36,-1.5; 15 2.36,-1.5; 16 2.36,-1; 17 2.36,-0.5; 18 2.36,0; 19 2.36,0.5; 20 2.36,1; 21 2.36,1.5 | smd 0.27 x 1.01: 8 -1.5,-2.36; 9 -1,-2.36; 10 -0.5,-2.36; 11 0,-2.36; 12 0.5,-2.36; 13 1,-2.36; 14 1.5,-2.36; 22 1.5,2.36; 23 1,2.36; 24 0.5,2.36; 25 0,2.36; 26 -0.5,2.36; 27 -1,2.36; 28 -1.5,2.36 | smd 3.25 x 3.25: 29 0,0
SOT229P700X180-4N = smd 1.31 x 0.93: 1 -3.345,2.29; 2 -3.345,0; 3 -3.345,-2.29 | smd 1.31 x 3.24: 4 3.345,0
SOIC127P600X175-8N = smd 1.97 x 0.59: 1 -2.475,1.905; 2 -2.475,0.635; 3 -2.475,-0.635; 4 -2.475,-1.905; 5 2.475,-1.905; 6 2.475,-0.635; 7 2.475,0.635; 8 2.475,1.905
SOIC127P600X175-8N' = smd 1.981 x 0.559: 1 -2.464,1.905; 2 -2.464,0.635; 3 -2.464,-0.635; 4 -2.464,-1.905; 5 2.464,-1.905; 6 2.464,-0.635; 7 2.464,0.635; 8 2.464,1.905
SOIC127P1034X264-28N = smd 1.981 x 0.559: 1 -4.699,8.255; 2 -4.699,6.985; 3 -4.699,5.715; 4 -4.699,4.445; 5 -4.699,3.175; 6 -4.699,1.905; 7 -4.699,0.635; 8 -4.699,-0.635; 9 -4.699,-1.905; 10 -4.699,-3.175; 11 -4.699,-4.445; 12 -4.699,-5.715; 13 -4.699,-6.985; 14 -4.699,-8.255; 15 4.699,-8.255; 16 4.699,-6.985; 17 4.699,-5.715; 18 4.699,-4.445; 19 4.699,-3.175; 20 4.699,-1.905; 21 4.699,-0.635; 22 4.699,0.635; 23 4.699,1.905; 24 4.699,3.175; 25 4.699,4.445; 26 4.699,5.715; 27 4.699,6.985; 28 4.699,8.255
ESP32-WROOM-32 = smd 2 x 0.9: 1 0,0; 2 0,-1.27; 3 -0.01,-2.54; 4 0,-3.84; 5 0,-5.08; 6 0,-6.35; 7 0,-7.62; 8 0,-8.89; 9 0,-10.16; 10 0,-11.43; 11 0,-12.7; 12 0,-13.97; 13 0,-15.24; 14 0,-16.51; 25 16.999,-16.511; 26 16.999,-15.239; 27 17.001,-13.971; 28 16.999,-12.702; 29 16.997,-11.432; 30 16.999,-10.161; 31 17.002,-8.891; 32 17,-7.622; 33 17,-6.35; 34 17,-5.08; 35 17,-3.81; 36 17,-2.54; 37 17,-1.27; 38 17,0 | smd 0.9 x 2: 15 2.785,-17.41; 16 4.055,-17.41; 17 5.325,-17.41; 18 6.595,-17.41; 19 7.865,-17.41; 20 9.135,-17.41; 21 10.405,-17.41; 22 11.675,-17.41; 23 12.945,-17.41; 24 14.215,-17.41 | smd 5 x 5: 39 7.502,-7.946

### Placement (x,y rotation side)
BT1  46.99,31.75 0 top
C1  10.16,78.74 0 bottom
C2  80.01,64.77 270 bottom
C3  10.16,82.55 0 bottom
C4  59.69,60.96 0 bottom
C6  49.53,72.39 0 top
C7  63.5,72.39 270 bottom
C8  58.42,72.39 270 bottom
C9  17.78,96.52 0 bottom
C10  17.78,55.88 90 top
C11  24.13,55.88 270 top
C12  27.94,55.88 270 top
C13  21.59,55.88 90 top
C14  46.99,87.63 180 bottom
C15  17.78,87.63 0 bottom
C16  19.05,74.93 90 top
C17  30.48,34.29 0 bottom
C18  30.48,31.75 0 bottom
C19  69.85,77.47 0 bottom
C20  69.85,80.01 0 bottom
C21  27.94,91.44 0 bottom
C22  27.94,88.9 180 bottom
C23  72.39,5.08 90 bottom
C24  17.78,80.01 0 bottom
C25  17.78,82.55 0 bottom
D1  59.69,91.44 0 bottom
D2  15.24,24.13 90 bottom
D3  69.85,31.75 180 bottom
DRY_CONTACT  83.82,43.18 270 top
IC1  38.1,64.77 0 top
J1  82.55,63.5 270 top
J2  17.78,11.43 180 top
J3  76.2,95.25 0 top
LED1  77.47,87.63 0 top
LED2  34.29,54.61 90 top
LED3  39.37,54.61 90 top
LED4  44.45,54.61 90 top
LED5  35.56,54.61 270 top
LED6  40.64,54.61 270 top
LED7  45.72,54.61 270 bottom
MAX232  22.86,64.77 0 top
POWER  83.82,77.47 270 top
PUSH_BUTTON  69.85,11.43 180 top
Q1  17.78,93.98 90 bottom
Q2  46.99,93.98 90 bottom
Q3  60.96,76.2 0 top
Q4  69.85,25.4 180 bottom
Q5  22.86,26.67 270 bottom
Q6  88.9,43.18 0 bottom
R1  59.69,88.9 0 bottom
R2  80.01,87.63 180 bottom
R3  68.58,64.77 90 bottom
R4  68.58,62.23 270 bottom
R5  59.69,63.5 180 bottom
R6  59.69,58.42 180 bottom
R8  85.09,66.04 90 bottom
R9  85.09,60.96 270 bottom
R10  48.26,85.09 0 bottom
R11  17.78,85.09 0 bottom
R12  48.26,82.55 0 bottom
R13  59.69,55.88 0 bottom
R14  30.48,19.05 0 bottom
R15  30.48,22.86 0 bottom
R17  16.51,29.21 0 bottom
R18  30.48,26.67 180 bottom
R19  20.32,19.05 180 bottom
R20  20.32,22.86 180 bottom
R21  48.26,90.17 0 bottom
R22  88.9,39.37 0 bottom
R23  59.69,81.28 0 bottom
R24  59.69,86.36 180 bottom
R25  59.69,83.82 0 bottom
R26  59.69,78.74 180 bottom
R27  88.9,45.72 0 bottom
R28  67.31,5.08 270 bottom
R29  69.85,5.08 270 bottom
R30  64.77,5.08 270 bottom
R31  35.56,50.8 270 bottom
R32  39.37,50.8 270 bottom
R33  44.45,50.8 270 bottom
R34  34.29,64.77 270 bottom
R35  38.1,64.77 270 bottom
R36  41.91,64.77 270 bottom
R37  17.78,90.17 0 bottom
R38  73.66,85.09 0 top
R39  73.66,82.55 0 top
R40  30.48,64.77 90 top
RELAY  69.85,27.94 0 top
RELAY_CONN  83.82,27.94 270 top
RS232  10.16,22.86 90 top
S1  46.99,92.71 270 top
S2  17.78,92.71 90 top
S3  55.88,92.71 0 top
SCANNER  44.45,11.43 180 top
SV1  10.16,57.15 270 top
SV2  10.16,36.83 270 top
SV3  16.51,35.56 270 top
U1  67.31,85.09 270 top
U2  10.16,81.28 180 top
U3  22.86,25.4 0 top
U4  CAT24C32WI-GT3  [SOIC127P600X175-8N']  22.86,36.83 0 top
U$2  60.96,63.5 0 top
U$3  24.13,90.17 0 top

### Tracks (layer width: path | path; a pad name or v marks a point on that pad's centre or on a via)
3V3  (22 unrouted)
BAT  (2 unrouted)
CS_IO19  (2 unrouted)
DTR  (2 unrouted)
EN  (6 unrouted)
EXT_5V  (28 unrouted)
GND  (81 unrouted)
  pour Top: 0,100.33 95.25,100.33 95.25,0 0,0
  pour Bottom: 0,100.33 95.25,100.33 95.25,0 0,0
INT_IO23  (1 unrouted)
IO0  (4 unrouted)
IO2  (2 unrouted)
IO4  (1 unrouted)
IO12  (2 unrouted)
IO13  (1 unrouted)
IO15  (1 unrouted)
IO32  (1 unrouted)
IO33  (1 unrouted)
IO34  (2 unrouted)
IO35  (2 unrouted)
LEDA  (1 unrouted)
LEDB  (1 unrouted)
N$1  (1 unrouted)
N$2  (1 unrouted)
N$3  (1 unrouted)
N$4  (3 unrouted)
N$5  (1 unrouted)
N$6  (1 unrouted)
N$7  (1 unrouted)
N$8  (3 unrouted)
N$9  (1 unrouted)
N$10  (1 unrouted)
N$11  (1 unrouted)
N$12  (1 unrouted)
N$14  (1 unrouted)
N$15  (1 unrouted)
N$16  (1 unrouted)
N$18  (1 unrouted)
N$19  (1 unrouted)
N$20  (1 unrouted)
N$21  (1 unrouted)
N$22  (1 unrouted)
N$23  (2 unrouted)
N$24  (1 unrouted)
N$26  (1 unrouted)
N$27  (2 unrouted)
N$28  (1 unrouted)
N$29  (2 unrouted)
N$32  (1 unrouted)
N$33  (2 unrouted)
N$35  (1 unrouted)
N$36  (2 unrouted)
N$37  (2 unrouted)
N$38  (2 unrouted)
N$40  (1 unrouted)
N$45  (2 unrouted)
N$46  (1 unrouted)
N$47  (1 unrouted)
N$48  (2 unrouted)
N$49  (2 unrouted)
OS1  (1 unrouted)
OS2  (1 unrouted)
OSC1  (2 unrouted)
OSC2  (2 unrouted)
RESET  (1 unrouted)
RTS  (2 unrouted)
RX_232  (2 unrouted)
RX_S  (1 unrouted)
RX_UART1_IO14  (1 unrouted)
RXD  (1 unrouted)
RXD0  (1 unrouted)
  Top 0.152: U$3.34 44.45,85.09
SCK_IO21  (1 unrouted)
SCL_IO5  (4 unrouted)
SDA_IO17  (4 unrouted)
SI_IO18  (1 unrouted)
SO_IO22  (1 unrouted)
SQ  (1 unrouted)
TPIN+  (2 unrouted)
TPIN-  (2 unrouted)
TPOUT+  (2 unrouted)
TPOUT-  (2 unrouted)
TX_232  (2 unrouted)
TX_S  (1 unrouted)
TX_UART1_IO27  (1 unrouted)
TX_UART2_IO26  (1 unrouted)
TXD  (1 unrouted)
TXD0  (1 unrouted)
USB_DN  (1 unrouted)
USB_DP  (1 unrouted)
VBUS  (3 unrouted)

### Text on the board
tNames: LCD | SIG | GND | NC | COM | NO | TX | RX | NC | GND | PRINTER | GND | NC | TX | RX | -VE | +VE | PB | PB